# EAGLE design tessel-raspi-b-plus (EAGLE 6.6.0)
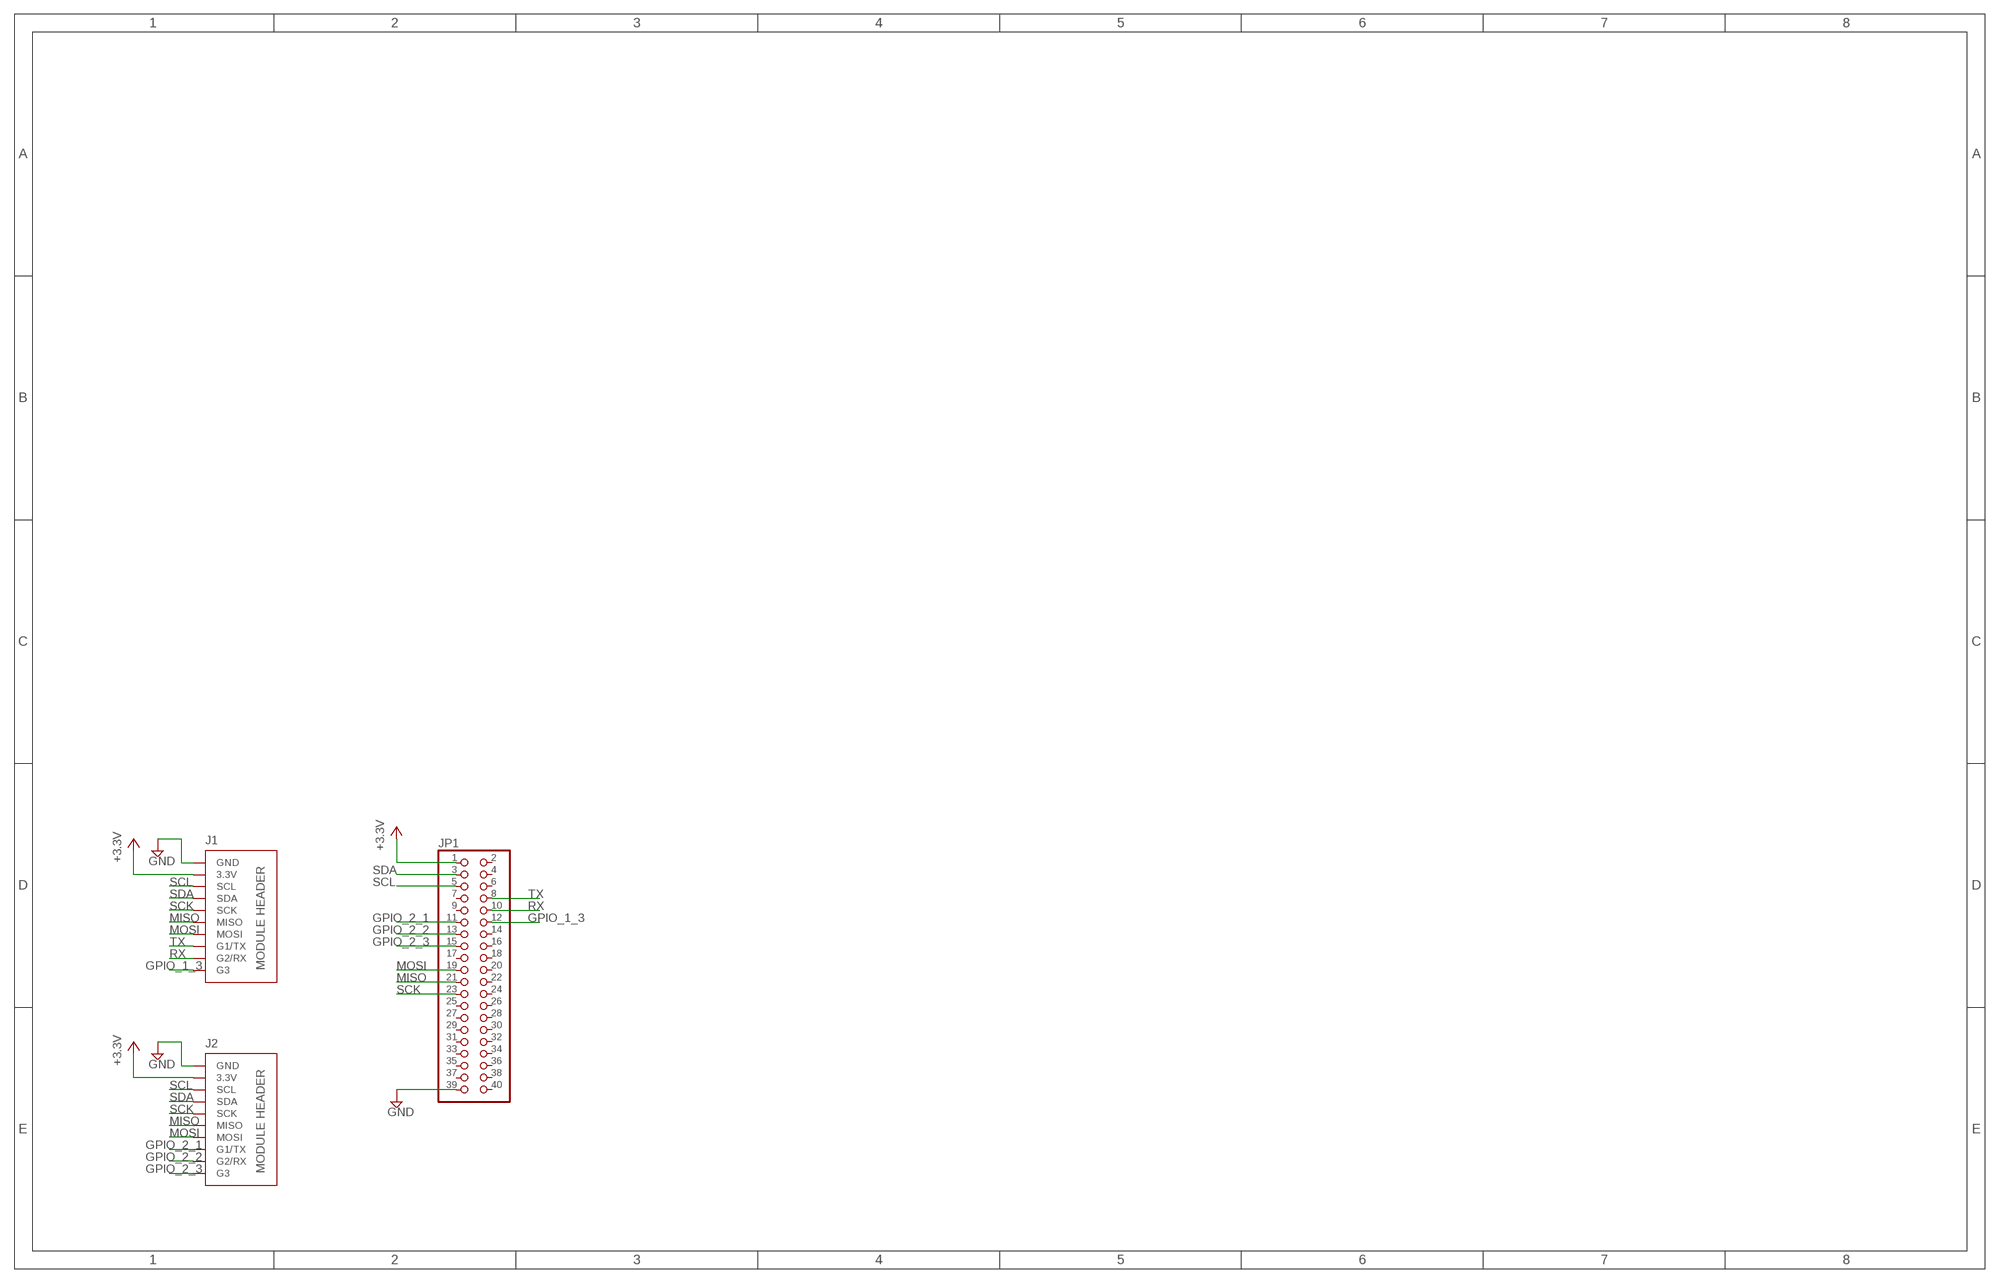
[diagram p0: schematic, sheet 1]

## Parts
J1  MODULE_HEADER_MODULEDEFAULT  [MODULE_HEADER_MODULE]
J2  MODULE_HEADER_MODULEDEFAULT  [MODULE_HEADER_MODULE]
JP1  PINHD-2X20  [2X20]

## Nets
+3.3V: J1.3.3V JP1.1
GND: J1.GND
GPIO_1_3: J1.G3 JP1.12
GPIO_2_1: J2.G1/TX JP1.11
GPIO_2_2: J2.G2/RX JP1.13
GPIO_2_3: J2.G3 JP1.15
MISO: J1.MISO J2.MISO JP1.21
MOSI: J1.MOSI J2.MOSI JP1.19
RX: J1.G2/RX JP1.10
SCK: J1.SCK J2.SCK JP1.23
SCL: J1.SCL J2.SCL JP1.5
SDA: J1.SDA J2.SDA JP1.3
TX: J1.G1/TX JP1.8
Unconnected: JP1.2 JP1.4 JP1.6 JP1.7 JP1.9 JP1.14 JP1.16 JP1.17 JP1.18 JP1.20 JP1.22 JP1.24 JP1.25 JP1.26 JP1.27 JP1.28 JP1.29 JP1.30 JP1.31 JP1.32 JP1.33 JP1.34 JP1.35 JP1.36 JP1.37 JP1.38 JP1.39 JP1.40

## Power pins joined to a net without a drawn wire
3.3V: J2.3.3V
GND: J2.GND

## Library data of the parts
J1 J2 = tm:MODULE_HEADER_MODULE
JP1 = pinhead:PINHD-2X20: PIN HEADER

## Board
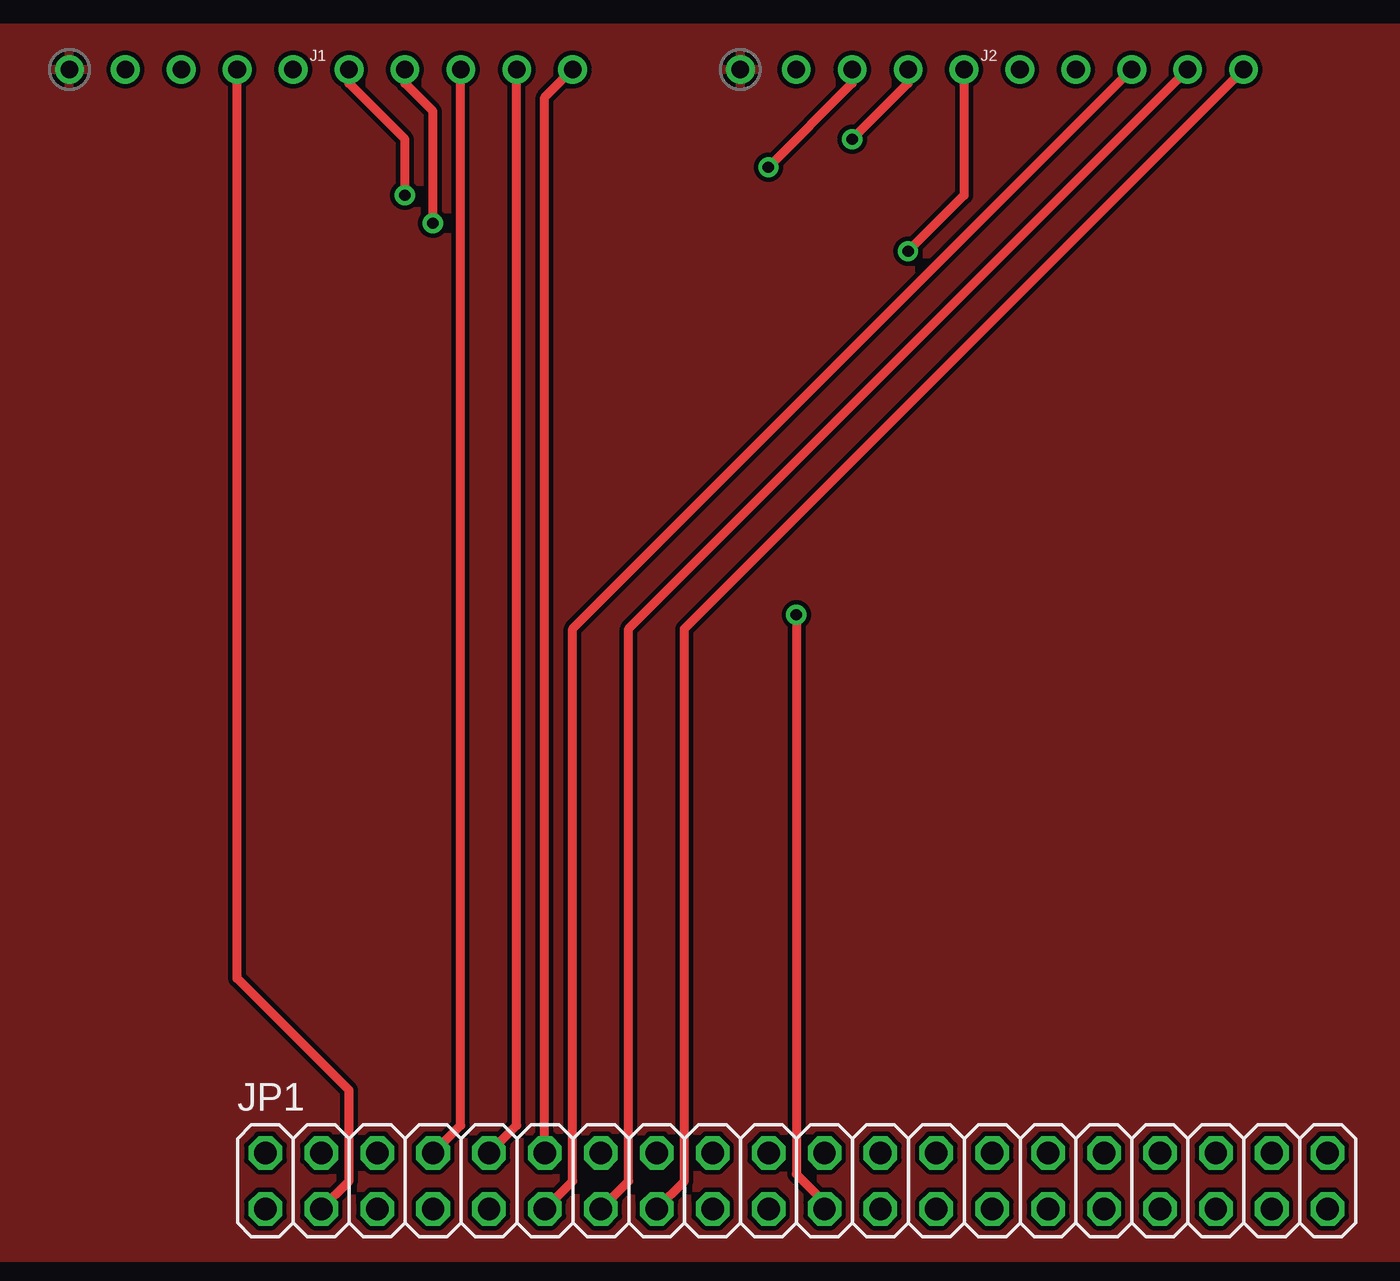
[diagram p1: board, top side]
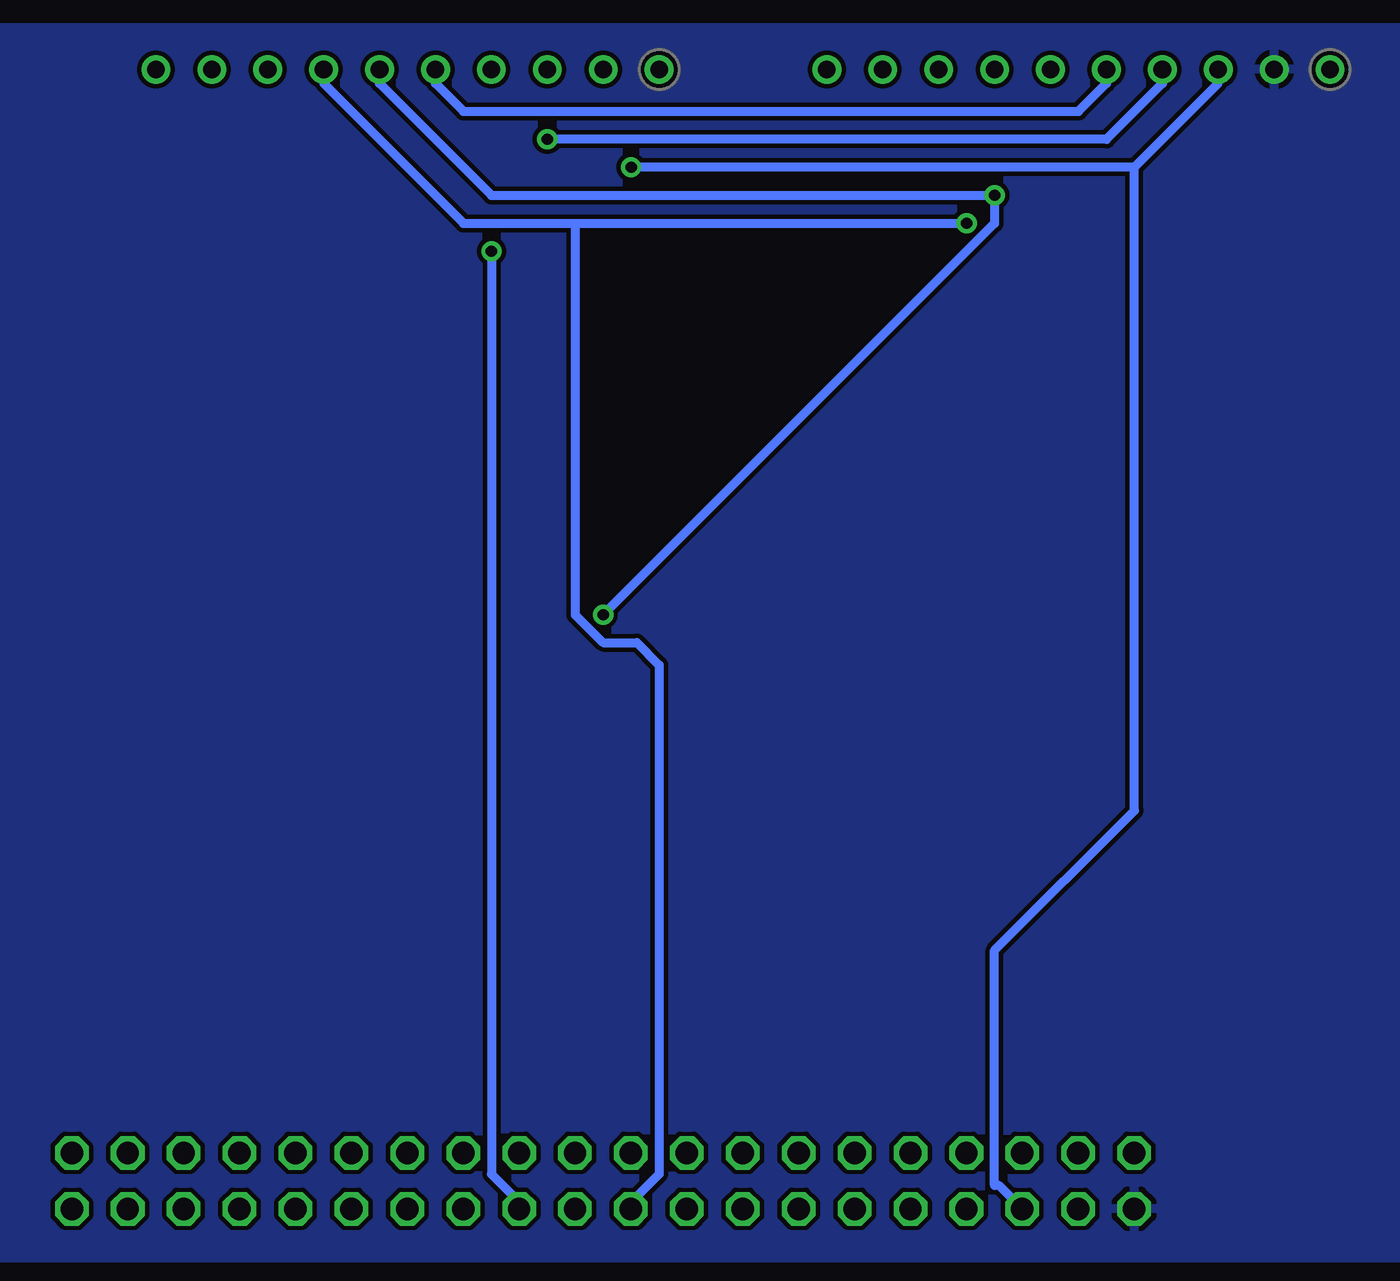
[diagram p2: board, bottom side, seen from below]

No outline drawn. Coordinates in mm, seen from the top.
Copper layers (1*16): Top 0.035mm / dielectric 1.5mm / Bottom 0.035mm
Design rules "default *": minimum track width 8mil, minimum drill 20mil, track to track 8mil, track to pad 8mil, pad to pad 8mil, via to via 8mil, smd to smd 8mil, copper to edge 20mil, drill to drill 8mil, minimum pad ring 10mil, minimum via ring 8mil, stop-mask expansion 4mil, vias tented up to drill 0mil, thermal gap 10mil

### Footprints (pad centres in the part's own frame; a part is rotated, then mirrored left to right if it is on the bottom)
MODULE_HEADER_MODULE = drill 0.8: 3.3V -8.89,0; G1/TX 6.35,0; G2/RX 8.89,0; G3 11.43,0; GND -11.43,0; MISO 1.27,0; MOSI 3.81,0; SCK -1.27,0; SCL -6.35,0; SDA -3.81,0
2X20 = drill 1.016 octagon: 1 -24.13,-1.27; 2 -24.13,1.27; 3 -21.59,-1.27; 4 -21.59,1.27; 5 -19.05,-1.27; 6 -19.05,1.27; 7 -16.51,-1.27; 8 -16.51,1.27; 9 -13.97,-1.27; 10 -13.97,1.27; 11 -11.43,-1.27; 12 -11.43,1.27; 13 -8.89,-1.27; 14 -8.89,1.27; 15 -6.35,-1.27; 16 -6.35,1.27; 17 -3.81,-1.27; 18 -3.81,1.27; 19 -1.27,-1.27; 20 -1.27,1.27; 21 1.27,-1.27; 22 1.27,1.27; 23 3.81,-1.27; 24 3.81,1.27; 25 6.35,-1.27; 26 6.35,1.27; 27 8.89,-1.27; 28 8.89,1.27; 29 11.43,-1.27; 30 11.43,1.27; 31 13.97,-1.27; 32 13.97,1.27; 33 16.51,-1.27; 34 16.51,1.27; 35 19.05,-1.27; 36 19.05,1.27; 37 21.59,-1.27; 38 21.59,1.27; 39 24.13,-1.27; 40 24.13,1.27

### Placement (x,y rotation side)
J1  33.02,53.98 0 top
J2  63.5,53.98 0 top
JP1  54.62,3.5 0 top

### Tracks (layer width: path | path; a pad name or v marks a point on that pad's centre or on a via)
+3.3V
  pour Bottom: 0,55.88 84.58,55.88 arc-90 87.12,53.34 87.12,2.54 arc-90 84.58,0 0,0
GND
  pour Top: 81.03,55.88 84.58,55.88 arc-90 87.12,53.34 87.12,2.54 arc-90 84.58,0 0,0 0,55.88
GPIO_1_3
  Top 0.406: JP1.12 43.18,4.78 43.18,52.7 J1.G3
GPIO_2_1
  Top 0.406: JP1.11 44.45,3.49 44.45,28.57 J2.G1/TX
GPIO_2_2
  Top 0.406: JP1.13 46.99,3.49 46.99,28.57 J2.G2/RX
GPIO_2_3
  Top 0.406: JP1.15 49.53,3.49 49.53,28.57 J2.G3
MISO  (via drill 0.51)
  Top 0.406: v36.83,48.26 36.83,50.8 34.29,53.34 J1.MISO | v54.61,29.21 54.61,3.81 55.89,2.53 JP1.21
  Bottom 0.406: J2.MISO 64.77,53.34 59.69,48.26 v36.83,48.26 36.83,46.99 v54.61,29.21
MOSI  (via drill 0.51)
  Top 0.406: v38.1,46.99 38.1,52.07 36.83,53.34 J1.MOSI
  Bottom 0.406: 55.88,46.99 60.96,46.99 67.31,53.34 J2.MOSI | 55.88,46.99 v38.1,46.99 | 55.88,46.99 55.88,29.21 54.61,27.94 53.09,27.94 52.07,26.92 52.07,3.81 53.35,2.53 JP1.19
RX
  Top 0.406: JP1.10 41.91,6.03 J1.G2/RX
SCK  (via drill 0.51)
  Top 0.406: v59.69,45.72 62.23,48.26 J2.SCK
  Bottom 0.406: J1.SCK 31.75,53.34 33.02,52.07 60.96,52.07 62.23,53.34 J2.SCK | v59.69,45.72 59.69,3.81 58.43,2.55 JP1.23
SCL  (via drill 0.51)
  Top 0.406: v53.34,49.53 57.15,53.34 J2.SCL
  Bottom 0.406: 30.48,49.53 v53.34,49.53 | 30.48,49.53 26.67,53.34 J1.SCL | JP1.5 36.64,3.3 36.83,3.3 36.83,13.97 30.48,20.32 30.48,49.53
SDA  (via drill 0.51)
  Top 0.406: JP1.3 34.29,3.49 34.29,7.62 29.21,12.7 J1.SDA | v57.15,50.8 59.69,53.34 J2.SDA
  Bottom 0.406: v57.15,50.8 31.75,50.8 29.21,53.34 J1.SDA
TX
  Top 0.406: JP1.8 39.37,6.03 J1.G1/TX

### Text on the board
tPlace: PTP-Adapter | Raspberry Pi B+ | Revision 0.0
201bmp: /Users/nlintz/Desktop/bw_bmp/hexagon_bw.bmp